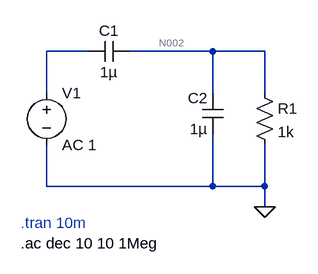
[diagram p0: schematic D_AC.asc]
D_AC.asc, the LTspice schematic file:
Version 4
SHEET 1 880 680
WIRE 128 96 64 96
WIRE 320 96 192 96
WIRE 400 96 320 96
WIRE 64 160 64 96
WIRE 320 160 320 96
WIRE 400 160 400 96
WIRE 64 304 64 240
WIRE 320 304 320 224
WIRE 320 304 64 304
WIRE 400 304 400 240
WIRE 400 304 320 304
WIRE 400 336 400 304
FLAG 400 336 0
SYMBOL cap 192 80 R90
WINDOW 0 0 32 VBottom 2
WINDOW 3 32 32 VTop 2
SYMATTR InstName C1
SYMATTR Value 1µ
SYMBOL cap 336 224 R180
WINDOW 0 24 56 Left 2
WINDOW 3 24 8 Left 2
SYMATTR InstName C2
SYMATTR Value 1µ
SYMBOL res 384 144 R0
SYMATTR InstName R1
SYMATTR Value 1k
SYMBOL voltage 64 144 R0
WINDOW 123 0 0 Left 0
WINDOW 39 0 0 Left 0
SYMATTR InstName V1
SYMATTR Value AC 1
TEXT 24 360 Left 2 ;.tran 10m
TEXT 24 392 Left 2 !.ac dec 10 10 1Meg

The netlist it stands for:
* D_AC.asc
C1 N002 N001 1µ
C2 0 N002 1µ
R1 N002 0 1k
V1 N001 0 AC 1
* .tran 10m
.ac dec 10 10 1Meg
.backanno
.end

* Results of the author's LTspice run, read from the files saved beside the schematic
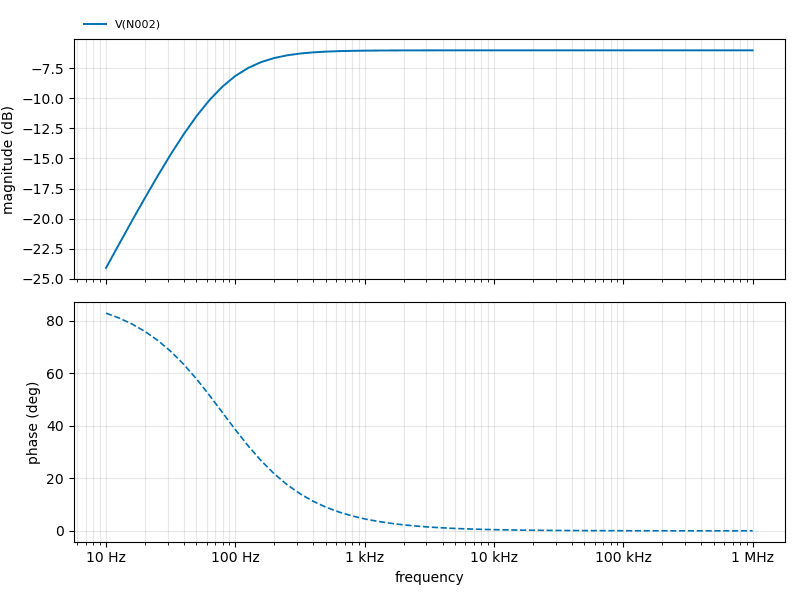
[diagram p1: AC Analysis of D_AC.asc, plotted from the saved traces]
* AC Analysis, 1 run:
*   V(N002): -24.10 dB at 10 Hz, -6.02 dB at 1 MHz, peak -6.02 dB at 1 MHz, 3 dB below the peak at 79.6 Hz